# Altium schematic sheet CATS-EUROC-PM.SchDoc: CATS EuRoC Edition
size A4; DocumentNumber: Overview; Revision: V1.0; SheetNumber: 1; SheetTotal: 1; Author: Luca Jost; Subtitle: Power Management
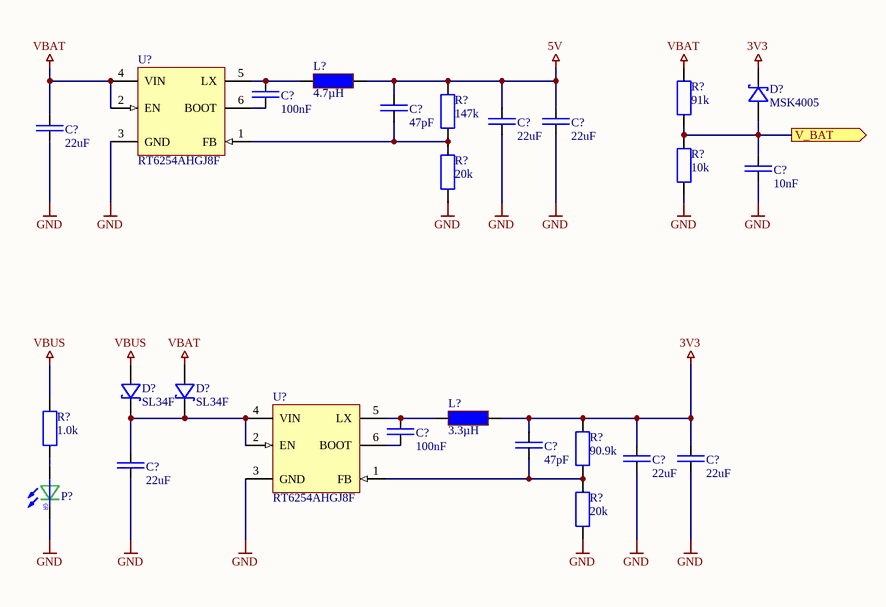
[diagram p0: CATS-EUROC-PM.SchDoc]

## Parts
(Parts that share a designator on the sheet are numbered #1, #2 ... from top to bottom, then left to right.)
C?#1  100nF  [SMD Keramikkondensator 0805]
C?#2  47pF  [SMD Keramikkondensator 0805]
C?#3  22uF  [SMD Keramikkondensator 0805]
C?#4  22uF  [SMD Keramikkondensator 0805]
C?#5  22uF  [SMD Keramikkondensator 0805]
C?#6  10nF  [SMD Keramikkondensator 0603]
C?#7  100nF  [SMD Keramikkondensator 0805]
C?#8  47pF  [SMD Keramikkondensator 0805]
C?#9  22uF  [SMD Keramikkondensator 0805]
C?#10  22uF  [SMD Keramikkondensator 0805]
C?#11  22uF  [SMD Keramikkondensator 0805]
D?#1  MSK4005  [SMD Diode SOD-523]
D?#2  SL34F  [SMD Diode SMAF]
D?#3  SL34F  [SMD Diode SMAF]
L?#1  4.7µH  [SMD Inductor 5.5x5.2x3]
L?#2  3.3µH  [SMD Inductor 2x2.5x1.2]
P?  LED  [SMD LED 0603]  (value not drawn)
R?#1  91k  [SMD Widerstand 0603]
R?#2  147k  [SMD Widerstand 0805]
R?#3  10k  [SMD Widerstand 0603]
R?#4  20k  [SMD Widerstand 0805]
R?#5  1.0k  [SMD Widerstand 0603]
R?#6  90.9k  [SMD Widerstand 0805]
R?#7  20k  [SMD Widerstand 0805]
U?#1  RT6254AHGJ8F  [SMD IC TSOT-23-6]
U?#2  RT6254AHGJ8F  [SMD IC TSOT-23-6]

## Ports
V_BAT (out)

## Nets
3V3: C?#8.2 C?#9.2 C?#10.2 D?#1.K L?#2.2 R?#6.2
5V: C?#2.2 C?#3.2 C?#4.2 L?#1.2 R?#2.2
GND: C?#3.1 C?#4.1 C?#5.1 C?#6.1 C?#9.1 C?#10.1 C?#11.1 P?.K R?#3.1 R?#4.1 R?#7.1 U?#1.3(GND) U?#2.3(GND)
VBAT: C?#5.2 D?#3.A R?#1.2 U?#1.2(EN) U?#1.4(VIN)
VBUS: D?#2.A R?#5.2
V_BAT: C?#6.2 D?#1.A R?#1.1 R?#3.2 ; port V_BAT
NetC?#1_1: C?#1.1 U?#1.6(BOOT)
NetC?#1_2: C?#1.2 L?#1.1 U?#1.5(LX)
NetC?#2_1: C?#2.1 R?#2.1 R?#4.2 U?#1.1(FB)
NetC?#7_1: C?#7.1 U?#2.6(BOOT)
NetC?#7_2: C?#7.2 L?#2.1 U?#2.5(LX)
NetC?#8_1: C?#8.1 R?#6.1 R?#7.2 U?#2.1(FB)
NetC?#11_2: C?#11.2 D?#2.K D?#3.K U?#2.2(EN) U?#2.4(VIN)
NetP?_A: P?.A R?#5.1

## Notes on the sheet
- Title
- Author:
- Subtitle
- Date:
- Rev:
- File:
- Sheet
- of
- (in symbol LED) GR

## Library data of the parts
C?#1 C?#7 = E6 - 100nF: SMD Ceramic Capacitor E6; Unit Price: 0.01; Number: -; Supplier: -
C?#2 C?#8 = E6 - 47pF: SMD Ceramic Capacitor E6; Unit Price: 0.01; Number: -; Supplier: -
C?#3-C?#5 C?#9-C?#11 = E6 - 22uF: SMD Ceramic Capacitor E6; Unit Price: 0.01; Number: -; Supplier: -
C?#6 = E6 - 10nF: SMD Ceramic Capacitor E6; Unit Price: 0.01; Number: -; Supplier: -
D?#1 = MSK4005: SOD-523 Schottky Barrier Diode; ComponentLink1Description: Datasheet; ComponentLink1URL: https://datasheet.lcsc.com/lcsc/1912111437_Shikues-MSK4005_C345957.pdf; JLC: C345957
D?#2 D?#3 = SL34F: 3A SMAF Schottky Barrier Diode; JLC: C113938; ComponentLink1Description: Datasheet; ComponentLink1URL: https://datasheet.lcsc.com/lcsc/1809211527_MDD-Microdiode-Electronics--SL34F_C113938.pdf
L?#1 = Inductor 4.7µH / 4.5A: 4.7 µH Shielded Molded Inductor 4.5 A 60mOhm Max Nonstandard; Digikey: 541-1238-2-ND; ComponentLink1Description: Datasheet; ComponentLink1URL: https://www.vishay.com/docs/34260/ihlp2020cz11.pdf; JLC: C408410
L?#2 = Inductor 3.3µH / 1.15A: 1.15A 3.3uH ±20% 144mΩ SMD Power Inductors; Digikey: 732-5680-2-ND; ComponentLink1Description: Datasheet; ComponentLink1URL: https://datasheet.lcsc.com/lcsc/2110081330_Sunlord-SPH252012H3R3MT_C98379.pdf; JLC: C98379
P? = LED: Color LED
R?#1 = E24 - 91k: SMD Chip Resistor E24; Unit Price: 0.01; Number: -; Supplier: -
R?#2 = E96 - 147k: SMD Chip Resistor E96; Unit Price: 0.01; Number: -; Supplier: -
R?#3 = E24 - 10k: SMD Chip Resistor E24; Unit Price: 0.01; Number: -; Supplier: -
R?#4 R?#7 = E96 - 20k: SMD Chip Resistor E96; Unit Price: 0.01; Number: -; Supplier: -
R?#5 = E24 - 1.0k: SMD Chip Resistor E24; Unit Price: 0.01; Number: -; Supplier: -
R?#6 = E96 - 90.9k: SMD Chip Resistor E96; Unit Price: 0.01; Number: -; Supplier: -
U?#1 U?#2 = RT6254AHGJ8F: Buck Switching Regulator IC Positive Adjustable 0.6V 1 Output 4A SOT-23-8 Thin, TSOT-23-8; ComponentLink1Description: Datasheet; ComponentLink1URL: https://www.richtek.com/assets/product_file/RT6254A=RT6254B/DS6254AB-02.pdf; Digikey: RT6254AHGJ8FTR-ND